# EasyEDA Pro project rp2354bv1e1.epro

# Schematic Schematic1

## Sheets
1 P1: Board Name: Board1; Create Date: 2026-07-01; Page Name: P1; Project Name: rp2354b; Schematic Name: Schematic1; Update Date: 2026-07-01; Company: EasyEDA.com; Page Size: A4; Version: V1.0
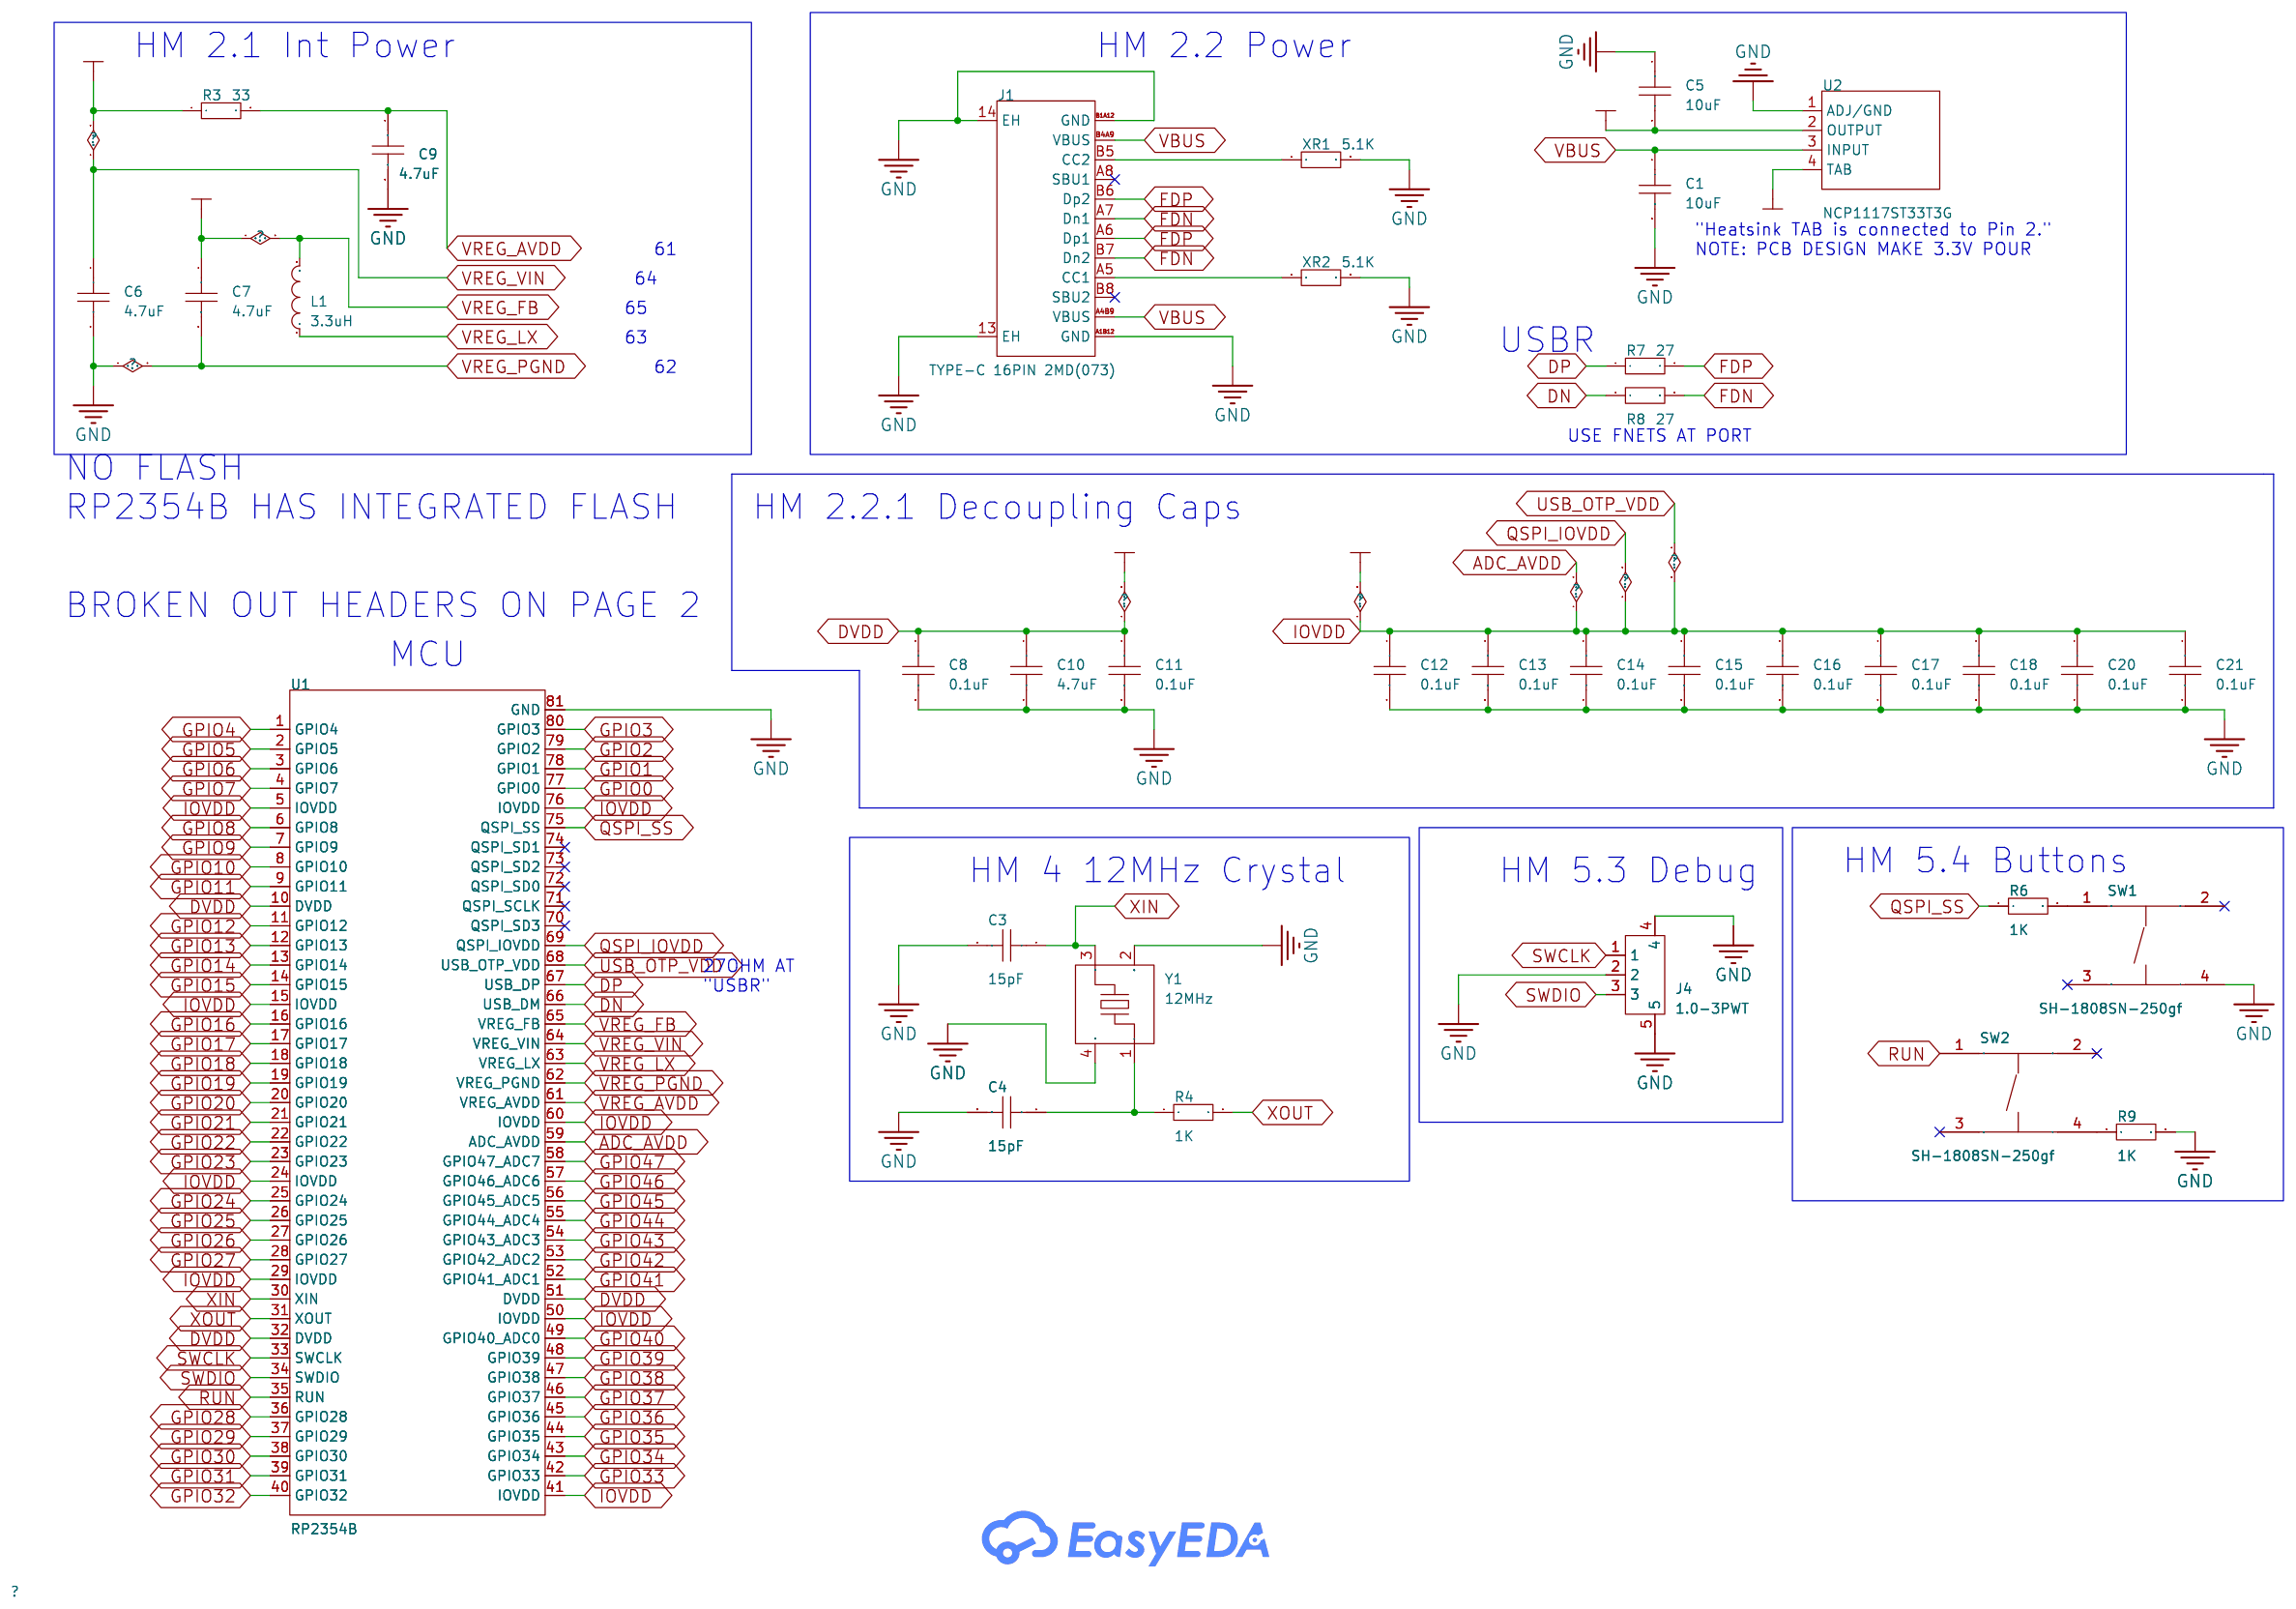
[diagram p0: P1]
2 P2: Create Date: 2026-06-30; Page Name: P2; Update Date: 2026-07-09
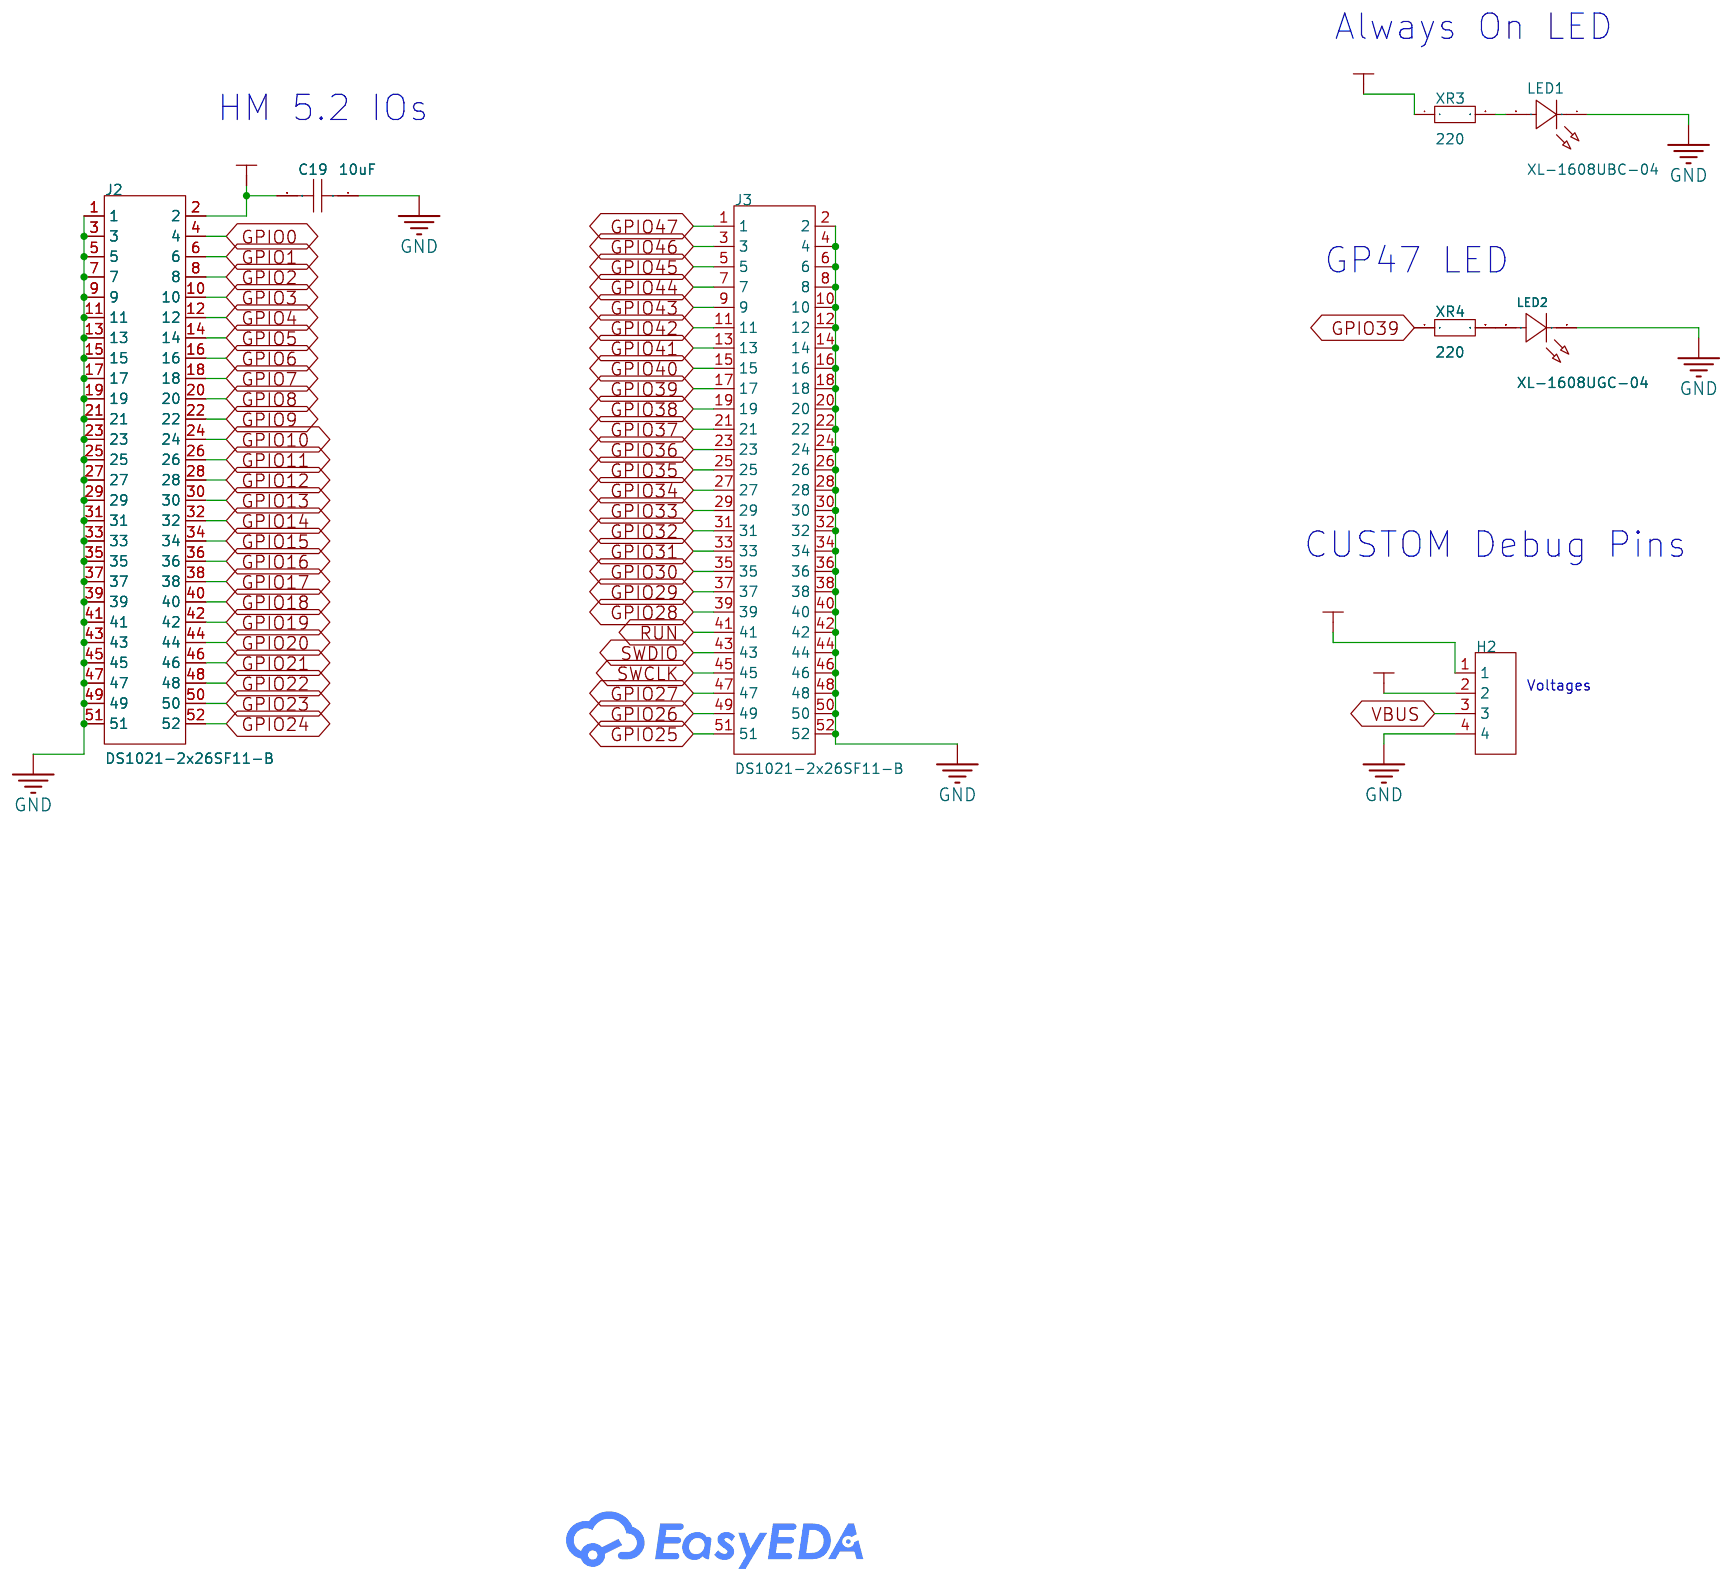
[diagram p1: P2]

## Parts
sheet P1
C1  10uF  [C0603]
C3  15pF  [C0603]
C4  15pF  [C0603]
C5  10uF  [C0603]
C6  4.7uF  [C0603]
C7  4.7uF  [C0603]
C8  0.1uF  [C0603]
C9  4.7uF  [C0603]
C10  4.7uF  [C0603]
C11  0.1uF  [C0603]
C12  0.1uF  [C0603]
C13  0.1uF  [C0603]
C14  0.1uF  [C0603]
C15  0.1uF  [C0603]
C16  0.1uF  [C0603]
C17  0.1uF  [C0603]
C18  0.1uF  [C0603]
C20  0.1uF  [C0603]
C21  0.1uF  [C0603]
J1  TYPE-C 16PIN 2MD(073)  [USB-C-SMD_TYPE-C-16PIN-2MD-073]
J4  1.0-3PWT  [CONN-SMD_3P-P1.00_C3029342]
L1  3.3uH  [IND-SMD_L2.0-W1.6_AOTA-B201610S3R3-101-T]
R3  33  [R0603]
R4  1K  [R0603]
R6  1K  [R0603]
R7  27  [R0603]
R8  27  [R0603]
R9  1K  [R0603]
SW1  SH-1808SN-250gf  [SW-SMD_4P-L4.2-W3.4-P2.15-LS5.2]
SW2  SH-1808SN-250gf  [SW-SMD_4P-L4.2-W3.4-P2.15-LS5.2]
U1  RP2354B  [QFN-80_L10.0-W10.0-P0.40-TL-EP3.4]
U2  NCP1117ST33T3G  [SOT-223-3_L6.5-W3.4-P2.30-LS7.0-BR]
XR1  5.1K  [R0603]
XR2  5.1K  [R0603]
Y1  12MHz  [CRYSTAL-SMD_4P-L3.2-W2.5-BL]
sheet P2
C19  10uF  [C0603]
H2  HX PH254-01-04-Z-L11.5 straight pin header  [HDR-TH_4P-HX-PH254-01-04-Z-L11.5]
J2  DS1021-2x26SF11-B  [HDR-TH_52P-P2.54-V-M-R2-C26-S2.54]
J3  DS1021-2x26SF11-B  [HDR-TH_52P-P2.54-V-M-R2-C26-S2.54]
LED1  XL-1608UBC-04  [LED0603-RD_BLUE]
LED2  XL-1608UGC-04  [LED0603-RD_GREEN]
XR3  220  [R0603]
XR4  220  [R0603]

## Library data of the parts
C1 C3-C21 = CAP_0603: Supplier Footprint: 0603
J1 = TYPE-C 16PIN 2MD(073): Connector Type:Type-C Protocol Standard:- Gender:Female Mounting Type:Surface Mount, Right Angle Number of Contacts:16P Number of Ports:1 Current Rating-Power:3A Voltage Rating:5V Connect-Disconnect Life:10,000 Cycles Supplementary Features:- Center Heigh; LCSC Part Name: Type-C 母 卧贴; Supplier Part: C2765186; Manufacturer: SHOU HAN(首韩); Supplier Footprint: SMD; JLCPCB Part Class: Extended Part; Datasheet: https://item.szlcsc.com/datasheet/TYPE-C%252016PIN%25202MD(073)/2901843.html; Supplier: LCSC; Connector Type: Type-C; Gender: Female; Mounting Type: Surface Mount, Right Angle; Number of Contacts: 16P; Number of Ports: 1; Current Rating-Power: 3A; Voltage Rating: 5V; Connect-Disconnect Life: 10,000 Cycles; Detection color: Black; Operating Temperature: -25℃~+85℃
J4 = 1.0-3PWT: Pins Structure:1x3P Pitch:1mm Mounting Type:Surface Mount, Right Angle Reference Series:SH Number of Pins:3P Number of Rows:1 Number of PINs Per Row:3 Contact Material:Phosphor bronze Contact Plating:Tin Operating Temperature:-20℃~+85℃ Operating Temperatu; LCSC Part Name: 1x3P 间距:1mm 卧贴 系列:SH; Supplier Part: C2763613; Manufacturer: FG(富港); Supplier Footprint: SMD,P=1mm,卧贴; JLCPCB Part Class: Extended Part; Datasheet: https://item.szlcsc.com/datasheet/1.0-3PWT/2893484.html; Supplier: LCSC; Pins Structure: 1x3P; Pitch: 1mm; Mounting Type: Surface Mount, Right Angle; Reference Series: SH; Number of Pins: 3P; Number of Rows: 1; Number of PINs Per Row: 3; Contact Material: Phosphor bronze; Contact Plating: Tin; Operating Temperature: -20℃~+85℃; Plastic Material: PA9T; Color: Beige; Z-Height of the Board: 3.05mm; Y-Width of Bottom Edge on Board: 3.75mm
L1 = AOTA-B201610S3R3-101-T: Inductance:3.3uH Current Rating:2.1A Current - Saturation(Isat):2.4A DC Resistance(DCR):115mΩ Type:Molded Inductor; LCSC Part Name: 3.3uH 2.4A; Supplier Part: C42411119; Manufacturer: ABRACON; Supplier Footprint: 0806; JLCPCB Part Class: Extended Part; Datasheet: https://item.szlcsc.com/datasheet/AOTA-B201610S3R3-101-T/44392932.html; Supplier: LCSC; Current Rating: 2.1A; Current - Saturation(Isat): 2.4A; DC Resistance(DCR): 115mΩ; Type: Molded Inductor
R3 R4 R6-R9 XR1-XR4 = Res_0603: Supplier Footprint: 0603
SW1 SW2 = SH-1808SN-250gf: Circuit:SPST-NO Actuator Style:Oval Button Operating Force:2.5N Mounting Type:Surface Mount,Vertical Length:4.2mm Width:3.4mm Switch Height:2.5mm with Bracket:Without Bracket Contact Current:50mA Voltage Rating:12V Actuator/Cap Color:White Termination Sty; LCSC Part Name: TS3425PA 250gf编带; Supplier Part: C52092028; Manufacturer: SHOU HAN(首韩); Supplier Footprint: SMD; JLCPCB Part Class: Extended Part; Datasheet: https://item.szlcsc.com/datasheet/SH-1808SN-250gf/54864052.html; Supplier: LCSC; Circuit: SPST-NO; Actuator Style: Oval Button; Operating Force: 2.5N; Mounting Type: Surface Mount,Vertical; Length: 4.2mm; Width: 3.4mm; Switch Height: 2.5mm; with Bracket: Without Bracket; Contact Current: 50mA; Voltage Rating: 12V; Actuator/Cap Color: White; Termination Style: PC Pin; Life: 50,000 cycles; Operating Temperature: -20℃~+70℃
U1 = RP2354B_C39843328: Program Storage Size:2MB Program Memory Type:OTP Number of I/O:48 Features:True random number generator (TRNG)；External pin reset (NRST); LCSC Part Name: 高性能安全微控制器; Supplier Part: C39843328; Manufacturer: Raspberry Pi(树莓派); Supplier Footprint: QFN-80-EP(10x10); JLCPCB Part Class: Extended Part; Datasheet: https://item.szlcsc.com/datasheet/RP2354B/41574627.html; Supplier: LCSC; Program Storage Size: 2MB; Program Memory Type: OTP; Number of I/O: 48; Features: True random number generator (TRNG)；External pin reset (NRST)
U2 = NCP1117ST33T3G: Output Configuration:Positive Voltage - Supply:20V Output Voltage:3.3V Output Voltage:3.3V Output Current:1A Power Supply Rejection Ratio (PSRR):62dB@(120Hz) Voltage Dropout:1.2V@(800mA) standby current:6mA Noise:0.003%Vout Features:Short Circuit Protecti; LCSC Part Name: 3.3V 1A 20V; Supplier Part: C26537; Manufacturer: onsemi(安森美); Supplier Footprint: SOT-223; JLCPCB Part Class: Extended Part; Datasheet: https://item.szlcsc.com/datasheet/NCP1117ST33T3G/27282.html; Supplier: LCSC; Output Configuration: Positive; Voltage - Supply: 20V; Output Voltage: 3.3V; Output Current: 1A; Power Supply Rejection Ratio (PSRR): 62dB@(120Hz); Voltage Dropout: 1.2V@(800mA); standby current: 6mA; Noise: 0.003%Vout; Features: Short Circuit Protection；Over Current Protection；Thermal shutdown; Operating Temperature: 0℃~+125℃@(Ta); Output Type: Fixed; Number of Outputs: 1
Y1 = ABM8-272-T3_C20625731: Type:Crystal Oscillator Frequency:12MHz Normal temperature Frequency Tolerance:±30ppm Normal temperature Frequency Tolerance:±30ppm Load Capacitance:10pF Frequency Stability:±30ppm Frequency Stability:±30ppm Equivalent Series Resistance(ESR):50Ω Operating; LCSC Part Name: 12MHz ±30ppm 10pF; Supplier Part: C20625731; Manufacturer: ABRACON; Manufacturer Part: ABM8-272-T3; Supplier Footprint: SMD3225-4P; JLCPCB Part Class: Extended Part; Datasheet: https://item.szlcsc.com/datasheet/ABM8-272-T3/22032038.html; Supplier: LCSC; Type: Crystal Oscillator; Normal temperature Frequency Tolerance: ±30ppm; Load Capacitance: 10pF; Frequency Stability: ±30ppm; Equivalent Series Resistance(ESR): 50Ω; Operating Temperature: -40℃~+85℃
H2 = HX PH254-01-04-Z-L11.5 straight pin header: Pin Structure:1x4P Pitch:2.54mm Circluar Pins/Square Pins:Pin Header Mounting Type:Through Hole Number of Rows:1 Number of Pins:4P Current Rating:3A Voltage Rating (Max):1kV Length of Mating Pin:6mm Insulation Height:2.5mm Length of End Connection Pin:3mm; LCSC Part Name: 1x4P 间距:2.54mm 方针 直插; Supplier Part: C52016392; Manufacturer: hanxia(韩下); Supplier Footprint: 插件,P=2.54mm; JLCPCB Part Class: Extended Part; Datasheet: https://item.szlcsc.com/datasheet/HX%2520PH254-01-04-Z-L11.5%2520straight%2520pin%2520header/54760437.html; Supplier: LCSC; Pin Structure: 1x4P; Pitch: 2.54mm; Circluar Pins/Square Pins: Pin Header; Mounting Type: Through Hole; Number of Rows: 1; Number of Pins: 4P; Current Rating: 3A; Voltage Rating (Max): 1kV; Length of Mating Pin: 6mm; Insulation Height: 2.5mm; Length of End Connection Pin: 3mm; Contact Material: Brass; Contact Plating: Gold; Operating Temperature: -40℃~+105℃
J2 J3 = DS1021-2x26SF11-B: Pin Structure:2x26P Pitch:2.54mm Row Spacing:2.54mm Circluar Pins/Square Pins:Pin Header Mounting Type:Through Hole Number of Rows:2 Number of Pins:52P Current Rating:3A Voltage Rating (Max):250V Contact Material:Copper Alloy Contact Plating:Gold Operatin; LCSC Part Name: 2x26P 间距:2.54mm 方针 直插; Supplier Part: C7430422; Manufacturer: CONNFLY; Supplier Footprint: 插件,P=2.54mm; JLCPCB Part Class: Extended Part; Datasheet: https://item.szlcsc.com/datasheet/DS1021-2x26SF11-B/8430075.html; Supplier: LCSC; Pin Structure: 2x26P; Pitch: 2.54mm; Row Spacing: 2.54mm; Circluar Pins/Square Pins: Pin Header; Mounting Type: Through Hole; Number of Rows: 2; Number of Pins: 52P; Current Rating: 3A; Voltage Rating (Max): 250V; Contact Material: Copper Alloy; Contact Plating: Gold; Operating Temperature: -40℃~+105℃; Color: Black
LED1 = XL-1608UBC-04: Lamp Holder Type:1.6mm x 0.8mm square LED Illumination Color:Blue Voltage - Forward(Vf):3.3V Voltage - Forward(Vf):3.3V Power(Watts):70mW Forward Current:20mA Wavelength - Dominant:455nm~475nm Wavelength - Dominant:455nm~475nm Peak Wavelength:470nm Peak W; LCSC Part Name: 0603蓝色贴片式发光二极管; Supplier Part: C965807; Manufacturer: XINGLIGHT(成兴光); Supplier Footprint: 0603; JLCPCB Part Class: Extended Part; Datasheet: https://item.szlcsc.com/datasheet/XL-1608UBC-04/1051416.html; Supplier: LCSC; Lamp Holder Type: 1.6mm x 0.8mm square LED; Illumination Color: Blue; Voltage - Forward(Vf): 3.3V; Power(Watts): 70mW; Forward Current: 20mA; Wavelength - Dominant: 455nm~475nm; Peak Wavelength: 470nm; Diode Configuration: Discrete Diode; Lens Color: Water Clear; Luminous Intensity: 300mcd; Viewing Angle: 120°; Mounting Style: Top-mount; Operating Temperature: -40℃~+85℃
LED2 = XL-1608UGC-04: Lamp Holder Type:1.6mm x 0.8mm square LED Illumination Color:Emerald Green Voltage - Forward(Vf):3.3V Voltage - Forward(Vf):3.3V Power(Watts):70mW Forward Current:20mA Wavelength - Dominant:515nm~535nm Wavelength - Dominant:515nm~535nm Peak Wavelength:525; LCSC Part Name: 0603翠绿贴片式发光二极管; Supplier Part: C965804; Manufacturer: XINGLIGHT(成兴光); Supplier Footprint: 0603; JLCPCB Part Class: Extended Part; Datasheet: https://item.szlcsc.com/datasheet/XL-1608UGC-04/1051413.html; Supplier: LCSC; Lamp Holder Type: 1.6mm x 0.8mm square LED; Illumination Color: Emerald Green; Voltage - Forward(Vf): 3.3V; Power(Watts): 70mW; Forward Current: 20mA; Wavelength - Dominant: 515nm~535nm; Peak Wavelength: 525nm; Diode Configuration: Discrete Diode; Lens Color: Water Clear; Luminous Intensity: 810mcd; Viewing Angle: 120°; Mounting Style: Top-mount; Operating Temperature: -40℃~+85℃

## Nets
1V1: C7.1 C8.1 C10.1 C11.1 H2.2 L1.2 U1.10(DVDD) U1.32(DVDD) U1.51(DVDD) U1.65(VREG_FB)
3V3: C5.2 C6.1 C12.1 C13.1 C14.1 C15.1 C16.1 C17.1 C18.1 C19.2 C20.1 C21.1 H2.1 J2.2 R3.1 U1.5(IOVDD) U1.15(IOVDD) U1.24(IOVDD) U1.29(IOVDD) U1.41(IOVDD) U1.50(IOVDD) U1.59(ADC_AVDD) U1.60(IOVDD) U1.64(VREG_VIN) U1.68(USB_OTP_VDD) U1.69(QSPI_IOVDD) U1.76(IOVDD) U2.2(OUTPUT) U2.4(TAB) XR3.1
GND: C1.2 C3.2 C4.2 C5.1 C6.2 C7.2 C8.2 C9.2 C10.2 C11.2 C12.2 C13.2 C14.2 C15.2 C16.2 C17.2 C18.2 C19.1 C20.2 C21.2 H2.4 J1.13(EH) J1.14(EH) J1.A1B12(GND) J1.B1A12(GND) J2.1 J2.3 J2.5 J2.7 J2.9 J2.11 J2.13 J2.15 J2.17 J2.19 J2.21 J2.23 J2.25 J2.27 J2.29 J2.31 J2.33 J2.35 J2.37 J2.39 J2.41 J2.43 J2.45 J2.47 J2.49 J2.51 J3.2 J3.4 J3.6 J3.8 J3.10 J3.12 J3.14 J3.16 J3.18 J3.20 J3.22 J3.24 J3.26 J3.28 J3.30 J3.32 J3.34 J3.36 J3.38 J3.40 J3.42 J3.44 J3.46 J3.48 J3.50 J3.52 J4.2 J4.4 J4.5 LED1.1(K) LED2.1(K) R9.2 SW1.4 U1.62(VREG_PGND) U1.81(GND) U2.1(ADJ/GND) XR1.2 XR2.2 Y1.2(GND) Y1.4(GND)
VBUS: C1.1 H2.3 J1.A4B9(VBUS) J1.B4A9(VBUS) U2.3(INPUT)
DN: R8.1 U1.66(USB_DM)
DP: R7.1 U1.67(USB_DP)
FDN: J1.A7(Dn1) J1.B7(Dn2) R8.2
FDP: J1.A6(Dp1) J1.B6(Dp2) R7.2
GPIO0: J2.4 U1.77(GPIO0)
GPIO1: J2.6 U1.78(GPIO1)
GPIO2: J2.8 U1.79(GPIO2)
GPIO3: J2.10 U1.80(GPIO3)
GPIO4: J2.12 U1.1(GPIO4)
GPIO5: J2.14 U1.2(GPIO5)
GPIO6: J2.16 U1.3(GPIO6)
GPIO7: J2.18 U1.4(GPIO7)
GPIO8: J2.20 U1.6(GPIO8)
GPIO9: J2.22 U1.7(GPIO9)
GPIO10: J2.24 U1.8(GPIO10)
GPIO11: J2.26 U1.9(GPIO11)
GPIO12: J2.28 U1.11(GPIO12)
GPIO13: J2.30 U1.12(GPIO13)
GPIO14: J2.32 U1.13(GPIO14)
GPIO15: J2.34 U1.14(GPIO15)
GPIO16: J2.36 U1.16(GPIO16)
GPIO17: J2.38 U1.17(GPIO17)
GPIO18: J2.40 U1.18(GPIO18)
GPIO19: J2.42 U1.19(GPIO19)
GPIO20: J2.44 U1.20(GPIO20)
GPIO21: J2.46 U1.21(GPIO21)
GPIO22: J2.48 U1.22(GPIO22)
GPIO23: J2.50 U1.23(GPIO23)
GPIO24: J2.52 U1.25(GPIO24)
GPIO25: J3.51 U1.26(GPIO25)
GPIO26: J3.49 U1.27(GPIO26)
GPIO27: J3.47 U1.28(GPIO27)
GPIO28: J3.39 U1.36(GPIO28)
GPIO29: J3.37 U1.37(GPIO29)
GPIO30: J3.35 U1.38(GPIO30)
GPIO31: J3.33 U1.39(GPIO31)
GPIO32: J3.31 U1.40(GPIO32)
GPIO33: J3.29 U1.42(GPIO33)
GPIO34: J3.27 U1.43(GPIO34)
GPIO35: J3.25 U1.44(GPIO35)
GPIO36: J3.23 U1.45(GPIO36)
GPIO37: J3.21 U1.46(GPIO37)
GPIO38: J3.19 U1.47(GPIO38)
GPIO39: J3.17 U1.48(GPIO39) XR4.1
GPIO40: J3.15 U1.49(GPIO40_ADC0)
GPIO41: J3.13 U1.52(GPIO41_ADC1)
GPIO42: J3.11 U1.53(GPIO42_ADC2)
GPIO43: J3.9 U1.54(GPIO43_ADC3)
GPIO44: J3.7 U1.55(GPIO44_ADC4)
GPIO45: J3.5 U1.56(GPIO45_ADC5)
GPIO46: J3.3 U1.57(GPIO46_ADC6)
GPIO47: J3.1 U1.58(GPIO47_ADC7)
QSPI_SS: R6.1 U1.75(QSPI_SS)
RUN: J3.41 SW2.1 U1.35(RUN)
SWCLK: J3.45 J4.1 U1.33(SWCLK)
SWDIO: J3.43 J4.3 U1.34(SWDIO)
VREG_AVDD: C9.1 R3.2 U1.61(VREG_AVDD)
VREG_LX: L1.1 U1.63(VREG_LX)
XIN: C3.1 U1.30(XIN) Y1.3
XOUT: R4.2 U1.31(XOUT)
$1N1729: J1.B5(CC2) XR1.1
$1N1837: J1.A5(CC1) XR2.1
$1N3371: C4.1 R4.1 Y1.1
$1N4063: R6.2 SW1.1
$1N4245: R9.1 SW2.4
$2N5716: LED1.2(A) XR3.2
$2N5881: LED2.2(A) XR4.2

Not connected (* = marked no-connect by the designer): J1 A8(SBU1)* B8(SBU2)*; SW1 2* 3*; SW2 2* 3*; U1 70(QSPI_SD3)* 71(QSPI_SCLK)* 72(QSPI_SD0)* 73(QSPI_SD2)* 74(QSPI_SD1)*

## Notes on the sheets
sheet 1
- HM 2.1 Int Power
- HM 2.2 Power
- 61
- "Heatsink TAB is connected to Pin 2."
  NOTE: PCB DESIGN MAKE 3.3V POUR
- 64
- 65
- 63
- USBR
- 62
- USE FNETS AT PORT
- NO FLASH
  RP2354B HAS INTEGRATED FLASH
- HM 2.2.1 Decoupling Caps
- BROKEN OUT HEADERS ON PAGE 2
- MCU
- HM 5.4 Buttons
- HM 4 12MHz Crystal
- HM 5.3 Debug
- 27OHM AT
  "USBR"
sheet 2
- Always On LED
- HM 5.2 IOs
- GP47 LED
- CUSTOM Debug Pins
- Voltages

# Board PCB1
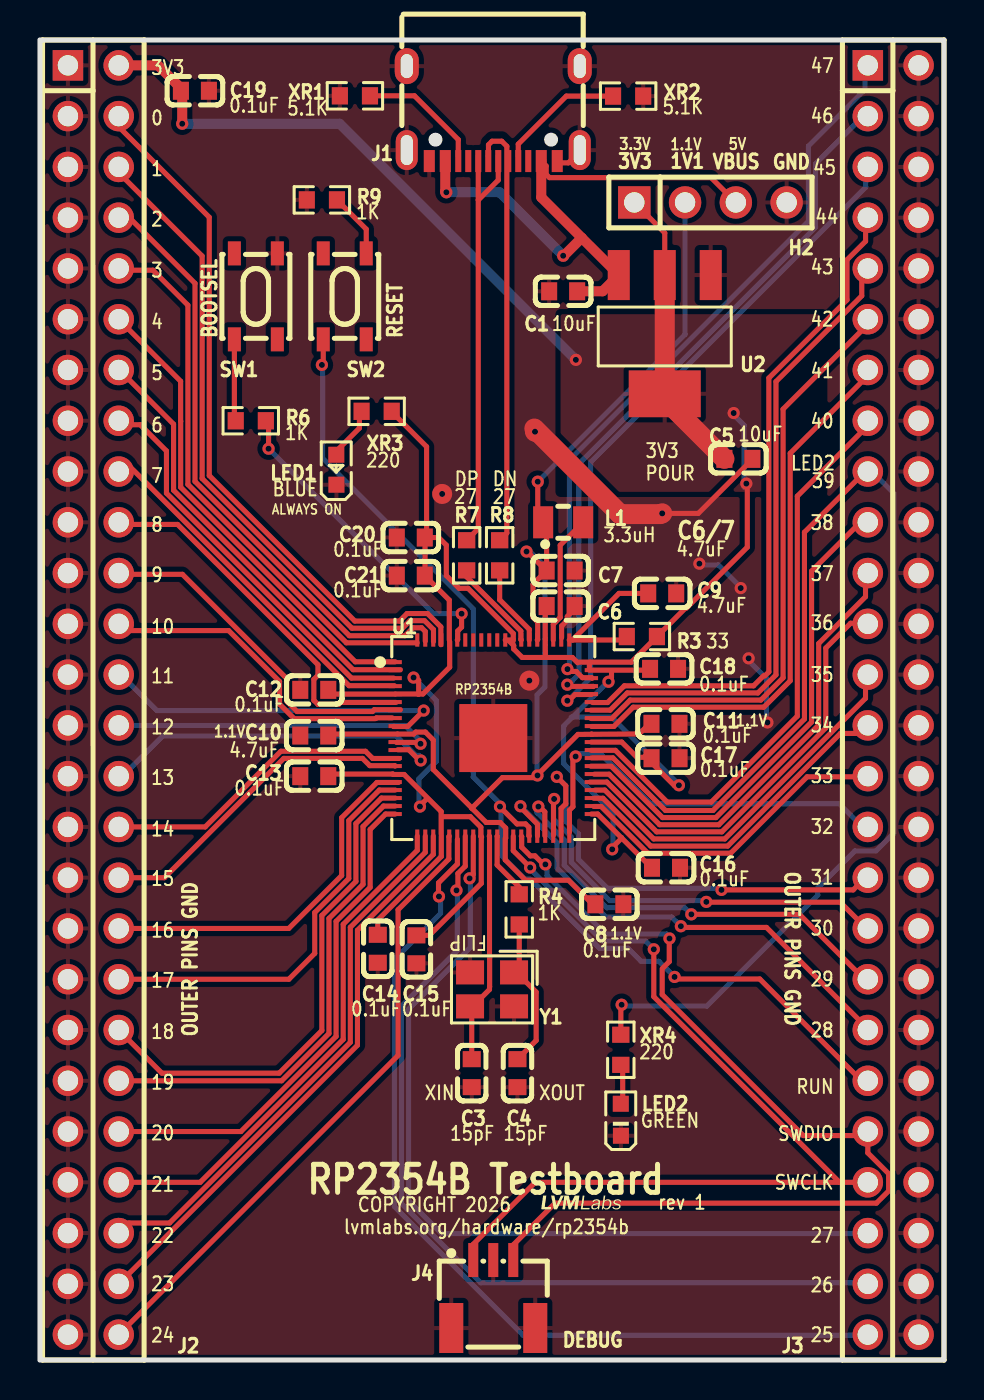
[diagram p2: board, top side]
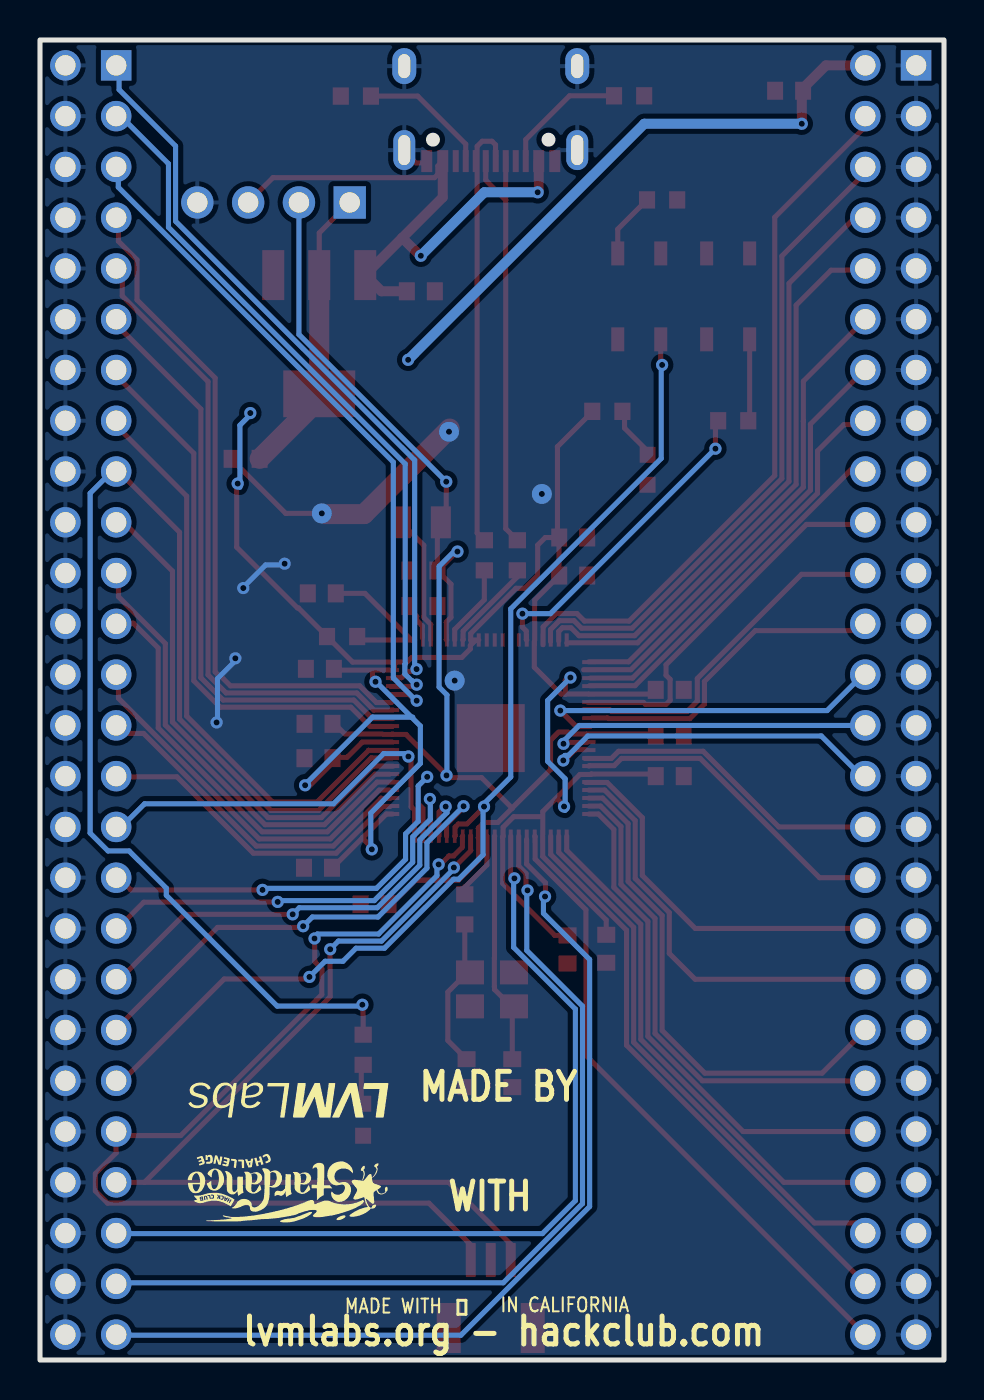
[diagram p3: board, bottom side, seen from below]

Outline 45.21 x 66.04 mm; copper layers: Top Layer, Bottom Layer. Coordinates in mm from the lower left corner of the outline.
Outline path: rectangle 0,66.04 45.21,0
Stack: Top Layer 0.035mm / Dielectric1 1.51mm FR4 er 4.5 / Bottom Layer 0.035mm

## Design rules (mm)
template: JLCPCB Capability(Two Layers Board)
spacing copperThickness1oz (default): track to track 0.102, other pairs 0.152 to 0.3
spacing copperThickness2oz: track to track 0.203, other pairs 0.152 to 0.3
track width copperThickness1oz (default): min 0.127, default 0.254, max 2.54
track width copperThickness2oz: min 0.203, default 0.254, max 2.54
differential pair differentialPair (default): width min 0.127, default 0.254, max 2.54; gap min 0.152, default 0.152
via viaSize (default): diameter min 0.5, default 0.61, max 10; hole min 0.3, default 0.305, max 6.3

## Placement (name value [footprint] x y rotation side)
C1  10uF  [C0603]  26.16 53.47 180 top
C3  15pF  [C0603]  21.59 14.35 270 top
C4  15pF  [C0603]  23.88 14.35 270 top
C5  10uF  [C0603]  34.93 45.08 180 top
C6  4.7uF  [C0603]  26.03 37.72 0 top
C7  4.7uF  [C0603]  26.03 39.5 0 top
C8  0.1uF  [C0603]  28.47 22.8 0 top
C9  4.7uF  [C0603]  31.12 38.35 0 top
C10  4.7uF  [C0603]  13.72 31.24 180 top
C11  0.1uF  [C0603]  31.28 31.83 0 top
C12  0.1uF  [C0603]  13.72 33.53 180 top
C13  0.1uF  [C0603]  13.72 29.21 180 top
C14  0.1uF  [C0603]  16.89 20.57 270 top
C15  0.1uF  [C0603]  18.82 20.55 270 top
C16  0.1uF  [C0603]  31.31 24.63 0 top
C17  0.1uF  [C0603]  31.28 30.11 0 top
C18  0.1uF  [C0603]  31.21 34.58 0 top
C19  10uF  [C0603]  7.75 63.5 180 top
C20  0.1uF  [C0603]  18.54 41.15 180 top
C21  0.1uF  [C0603]  18.54 39.24 180 top
H2  HX PH254-01-04-Z-L11.5 straight pin header  [HDR-TH_4P-HX-PH254-01-04-Z-L11.5]  33.53 57.91 0 top
J1  TYPE-C 16PIN 2MD(073)  [USB-C-SMD_TYPE-C-16PIN-2MD-073]  22.67 62.36 180 top
J2  DS1021-2x26SF11-B  [HDR-TH_52P-P2.54-V-M-R2-C26-S2.54]  2.67 33.02 270 top
J3  DS1021-2x26SF11-B  [HDR-TH_52P-P2.54-V-M-R2-C26-S2.54]  42.67 33.02 270 top
J4  1.0-3PWT  [CONN-SMD_3P-P1.00_C3029342]  22.67 3.3 0 top
L1  3.3uH  [IND-SMD_L2.0-W1.6_AOTA-B201610S3R3-101-T]  26.16 41.91 180 top
LED1  XL-1608UBC-04  [LED0603-RD_BLUE]  14.82 44.54 90 top
LED2  XL-1608UGC-04  [LED0603-RD_GREEN]  29.05 12.02 90 top
R3  33  [R0603]  30.1 36.19 180 top
R4  1K  [R0603]  23.97 22.54 90 top
R6  1K  [R0603]  10.54 46.99 180 top
R7  27  [R0603]  21.34 40.26 90 top
R8  27  [R0603]  22.99 40.26 90 top
R9  1K  [R0603]  14.1 58.04 180 top
SW1  SH-1808SN-250gf  [SW-SMD_4P-L4.2-W3.4-P2.15-LS5.2]  10.79 53.21 90 top
SW2  SH-1808SN-250gf  [SW-SMD_4P-L4.2-W3.4-P2.15-LS5.2]  15.24 53.21 90 top
U1  RP2354B  [QFN-80_L10.0-W10.0-P0.40-TL-EP3.4]  22.67 31.11 0 top
U2  NCP1117ST33T3G  [SOT-223-3_L6.5-W3.4-P2.30-LS7.0-BR]  31.24 51.31 90 top
XR1  5.1K  [R0603]  15.75 63.25 180 top
XR2  5.1K  [R0603]  29.41 63.23 0 top
XR3  220  [R0603]  16.84 47.46 180 top
XR4  220  [R0603]  29.05 15.52 270 top
Y1  12MHz  [CRYSTAL-SMD_4P-L3.2-W2.5-BL]  22.61 18.54 180 top

## Footprints (pads in the part's own frame, mm; a bottom-side part is the same pattern mirrored in y, then rotated)
C0603
  rect 0.8x0.9 smd: 1(-0.7,0) 2(0.7,0)
CONN-SMD_3P-P1.00_C3029342
  rect 0.5x1.7 smd: 1(-1,1.7) 2(0,1.7) 3(1,1.7)
  rect 1.2x2.5 smd: 4(2.1,-1.7) 5(-2.1,-1.7)
CRYSTAL-SMD_4P-L3.2-W2.5-BL
  rect 1.4x1.2 smd: 1(-1.1,-0.85) 2(1.1,-0.85) 3(1.1,0.85) 4(-1.1,0.85)
HDR-TH_4P-HX-PH254-01-04-Z-L11.5
  rect 1.62x1.62 hole 1.02: 1(-3.81,0)
  round 1.62 hole 1.02: 2(-1.27,0) 3(1.27,0) 4(3.81,0)
HDR-TH_52P-P2.54-V-M-R2-C26-S2.54
  rect 1.524x1.524 hole 1.02: 1(-31.75,-1.27)
  round 1.524 hole 1.02: 2(-31.75,1.27) 3(-29.21,-1.27) 4(-29.21,1.27) 5(-26.67,-1.27) 6(-26.67,1.27) 7(-24.13,-1.27) 8(-24.13,1.27) 9(-21.59,-1.27) 10(-21.59,1.27) 11(-19.05,-1.27) 12(-19.05,1.27) 13(-16.51,-1.27) 14(-16.51,1.27) 15(-13.97,-1.27) 16(-13.97,1.27) 17(-11.43,-1.27) 18(-11.43,1.27) 19(-8.89,-1.27) 20(-8.89,1.27) 21(-6.35,-1.27) 22(-6.35,1.27) 23(-3.81,-1.27) 24(-3.81,1.27) 25(-1.27,-1.27) 26(-1.27,1.27) 27(1.27,-1.27) 28(1.27,1.27) 29(3.81,-1.27) 30(3.81,1.27) 31(6.35,-1.27) 32(6.35,1.27) 33(8.89,-1.27) 34(8.89,1.27) 35(11.43,-1.27) 36(11.43,1.27) 37(13.97,-1.27) 38(13.97,1.27) 39(16.51,-1.27) 40(16.51,1.27) 41(19.05,-1.27) 42(19.05,1.27) 43(21.59,-1.27) 44(21.59,1.27) 45(24.13,-1.27) 46(24.13,1.27) 47(26.67,-1.27) 48(26.67,1.27) 49(29.21,-1.27) 50(29.21,1.27) 51(31.75,-1.27) 52(31.75,1.27)
IND-SMD_L2.0-W1.6_AOTA-B201610S3R3-101-T
  rect 1x1.6 smd: 1(-1,0) 2(1,0)
LED0603-RD_BLUE
  rect 0.8x0.8 smd: 1(-0.749,-0.004) 2(0.749,0.004)
LED0603-RD_GREEN
  rect 0.8x0.8 smd: 1(-0.799,-0.004) 2(0.799,0.004)
QFN-80_L10.0-W10.0-P0.40-TL-EP3.4
  rect 0.665x0.2 smd: 1(-4.907,3.8) 2(-4.907,3.4) 3(-4.907,3) 4(-4.907,2.6) 5(-4.907,2.2) 6(-4.907,1.8) 7(-4.907,1.4) 8(-4.907,1) 9(-4.907,0.6) 10(-4.907,0.2) 11(-4.907,-0.2) 12(-4.907,-0.6) 13(-4.907,-1) 14(-4.907,-1.4) 15(-4.907,-1.8) 16(-4.907,-2.2) 17(-4.907,-2.6) 18(-4.907,-3) 19(-4.907,-3.4) 20(-4.907,-3.8) 41(4.907,-3.8) 42(4.907,-3.4) 43(4.907,-3) 44(4.907,-2.6) 45(4.907,-2.2) 46(4.907,-1.8) 47(4.907,-1.4) 48(4.907,-1) 49(4.907,-0.6) 50(4.907,-0.2) 51(4.907,0.2) 52(4.907,0.6) 53(4.907,1) 54(4.907,1.4) 55(4.907,1.8) 56(4.907,2.2) 57(4.907,2.6) 58(4.907,3) 59(4.907,3.4) 60(4.907,3.8)
  rect 0.2x0.665 smd: 21(-3.8,-4.907) 22(-3.4,-4.907) 23(-3,-4.907) 24(-2.6,-4.907) 25(-2.2,-4.907) 26(-1.8,-4.907) 27(-1.4,-4.907) 28(-1,-4.907) 29(-0.6,-4.907) 30(-0.2,-4.907) 31(0.2,-4.907) 32(0.6,-4.907) 33(1,-4.907) 34(1.4,-4.907) 35(1.8,-4.907) 36(2.2,-4.907) 37(2.6,-4.907) 38(3,-4.907) 39(3.4,-4.907) 40(3.8,-4.907) 61(3.8,4.907) 62(3.4,4.907) 63(3,4.907) 64(2.6,4.907) 65(2.2,4.907) 66(1.8,4.907) 67(1.4,4.907) 68(1,4.907) 69(0.6,4.907) 70(0.2,4.907) 71(-0.2,4.907) 72(-0.6,4.907) 73(-1,4.907) 74(-1.4,4.907) 75(-1.8,4.907) 76(-2.2,4.907) 77(-2.6,4.907) 78(-3,4.907) 79(-3.4,4.907) 80(-3.8,4.907)
  rect 3.4x3.4 smd: 81(0,0)
R0603
  rect 0.806x0.864 smd: 1(-0.753,0) 2(0.753,0)
SOT-223-3_L6.5-W3.4-P2.30-LS7.0-BR
  rect 2.5x1.1 smd: 1(2.97,-2.3) 2(2.97,0) 3(2.97,2.3)
  rect 2.34x3.6 smd: 4(-2.97,0)
SW-SMD_4P-L4.2-W3.4-P2.15-LS5.2
  rect 1.2x0.65 smd: 1(-2.15,1.075) 2(2.15,1.075) 3(-2.15,-1.075) 4(2.15,-1.075)
USB-C-SMD_TYPE-C-16PIN-2MD-073
  oval 1.1x2 hole 0.6x1.5: 13(-4.325,1.825) 14(4.325,1.825)
  oval 1.2x1.8 hole 0.6x1.2: 13(-4.325,-2.375) 14(4.325,-2.375)
  rect 0.55x1.1 smd: A1B12(-3.2,2.375) A4B9(-2.4,2.375) B1A12(3.2,2.375) B4A9(2.4,2.375)
  rect 0.3x1.1 smd: A5(-1.25,2.375) A6(-0.25,2.375) A7(0.25,2.375) A8(1.25,2.375) B5(1.75,2.375) B6(0.75,2.375) B7(-0.75,2.375) B8(-1.75,2.375)

## Nets
As in the schematic.

Pads without a net: J1 A8 B8; SW1 2 3; SW2 2 3; U1 70 71 72 73 74

## Via types
v1: diameter 1, hole 0.305, Top Layer to Bottom Layer, 4 vias
v2: diameter 0.61, hole 0.305, Top Layer to Bottom Layer, 46 vias

## Routing (per net, layer and track width the routed paths; a pad name or vN(x,y) marks a point on that pad's centre or on a via; arc(x,y) is an arc through that point)
1V1: length 68
  Top Layer w0.254: U1.65 24.89,36.04 24.89,36.92 24.66,37.15 24.66,38.82 C7.1 25.34,41.74 L1.2 24.89,42.18 v2(24.89,43.94) ; 21.6,27.61 21.6,27.61 19.67,29.54 19.67,31.02 19.27,31.41 18.79,31.41 18.69,31.32 17.88,31.32 17.87,31.32 ; 21.6,27.61 23.12,29.14 24.74,29.14 26.9,31.3 27.59,31.3 ; 21.6,27.61 21.64,27.58 ; 21.6,27.61 21.6,27.61 22.31,26.89 23.01,26.89 23.29,26.61 23.29,26.11 23.26,26.08 ; C10.1 14.49,31.31 U1.10 ; 25.31,39.5 24.41,40.39 24.28,40.39 ; U1.51 27.59,31.3 ; 27.59,31.3 29.97,31.32 30.47,31.82 ; 27.59,31.3 27.59,31.3 ; 23.27,26.08 23.27,25.02 24.28,24 26.43,24 27.7,22.73
  Bottom Layer w0.254: v2(24.89,43.94) 32.26,51.31 H2.2 ; 24.42,40.53 25.25,39.7 25.25,33.67 24.86,33.27 24.86,29.3
  vias: v2(24.33,40.45) v2(24.88,29.25)
3V3: length 161.1
  Top Layer w0.254: 26.88,34.91 27.49,34.91 27.5,34.92 ; 30.52,34.45 30.46,34.51 U1.59 ; 35.37,43.83 35.37,40.66 32.33,37.62 32.28,37.62 30.95,36.29 ; C12.1 14.63,33.31 U1.5 ; 29.08,26.12 30.6,24.6 30.6,24.5 ; 29.08,26.12 29.08,26.14 ; 29.08,26.12 29.08,26.11 28.55,25.57 ; 29.08,26.12 27.89,27.31 U1.41 ; 20.09,27.18 21.52,27.18 22.05,26.66 22.05,26.2 22.08,26.16 ; U1.76 20.47,38.02 19.28,39.21 ; 20.06,26.31 20.06,27.44 18.21,29.29 17.67,29.29 17.64,29.32 ; 26.88,34.88 26.62,35.15 24.11,35.15 23.69,35.57 23.69,35.74 23.44,35.99 ; C6.1 25.27,37.65 25.27,36.07 25.27,35.23 25.2,35.16 ; 18.72,34.22 18.94,34 18.94,33.32 ; U1.69 U1.68 23.67,36.35 21.41,38.61 20.96,38.61 20.32,39.24 20.32,40.77 19.94,41.15 C20.1 ; H2.1 31.24,56.39 U2.2 ; 17.78,33.32 18.94,33.32 ; 18.94,33.32 18.94,33.3 ; 18.94,33.32 19.15,33.32 20.49,34.66 20.49,35.94 ; 19.26,41.07 19.26,39.18 19.21,39.14 ; 27.47,34.51 27.47,34.89 ; 22.07,26.16 22.07,23.85 19.47,21.25 C15.1 ; 17.64,29.31 14.52,29.31 C13.1 ; 30.25,30.15 29.86,30.15 29.09,30.91 U1.50 ; U1.60 29.57,34.91 R3.1 ; U1.24 20.07,25.19 16.89,22.01 C14.1 ; 19.08,27.68 19.08,27.81 19.35,28.08 ; 17.56,47.47 19.33,45.69 19.33,41.27 19.18,41.11 ; 28.49,34.06 28.58,34.15 28.58,34.44 ; 30.25,30.21 31.73,28.74 31.96,28.74
  Top Layer w0.5: 7.11,63.56 5.9,64.77 J2.2 ; C19.2 7.11,63.43 v2(7.11,61.85)
  Top Layer w1: 34.22,45.08 31.24,48.07 U2.4 U2.2
  Bottom Layer w0.254: 26.56,32.16 26.63,32.16 ; 26.63,32.16 26.19,31.72 26.19,29.85 ; 26.63,32.16 28.58,32.16 31.95,28.79 ; 26.63,32.16 28.4,33.94 ; 18.75,34.06 19.82,32.99 19.82,29.95 18.95,29.08 18.95,27.49 ; 28.66,25.49 28.66,27.37 26.18,29.85 ; 34.68,47.29 35.21,46.76 35.21,43.66
  Bottom Layer w0.5: v2(26.8,50.04) 14.99,61.85 v2(7.11,61.85)
  vias: v2(18.68,34.14) v2(19,27.69) v2(28.43,33.93) v2(28.61,25.55) v2(31.95,28.75) v2(34.69,47.38) v2(35.32,43.85)
GND: length 22.7
  Top Layer w0.254: 25.89,59.89 26.42,59.89 26.9,60.37 ; v1(31.12,42.36) 32.92,42.36 35.53,44.97 ; 26.79,37.62 26.37,37.2 26.37,37.01 26.08,36.72 26.08,36.14
  Top Layer w1: 31.02,42.32 29,42.32 24.72,46.6
  Bottom Layer w0.254: 36.33,31.8 36.33,34.09 35.4,35.02 ; 33.02,39.78 33.92,39.78 35.06,38.64
  vias: v1(20.11,43.33) v1(24.47,33.99) v1(24.75,46.44) v2(32.97,39.84) v2(35.04,38.62) v2(35.44,35.1) v2(36.38,31.9)
VBUS: length 30.6
  Top Layer w0.254: H2.3 33.56,59.15 25.48,59.15 25.31,59.32 25.31,59.74 J1.A4B9
  Top Layer w0.5: v2(26.16,55.24) 26.19,55.24 27.09,56.14 ; v2(20.32,58.42) 20.27,58.47 J1.B4A9 ; 27.09,56.14 25.07,58.17 J1.A4B9 ; 27.09,56.14 28.94,54.29 U2.3 28.13,53.47 C1.1
  Bottom Layer w0.5: v2(20.32,58.42) 22.99,58.42 v2(26.16,55.24)
DN: length 4.1
  Top Layer w0.254: U1.66 24.47,36.55 22.99,38.03 R8.1
DP: length 4.6
  Top Layer w0.254: U1.67 24.05,36.04 24.05,36.47 21.34,39.18 R7.1
FDN: length 21.5
  Top Layer w0.254: R8.2 23.35,41.37 23.35,60.72 23.09,60.97 22.61,60.97 22.43,60.79 22.43,60.25 22.42,60.24
FDP: length 22.1
  Top Layer w0.254: 21.92,58.03 21.92,41.59 R7.2 ; 21.92,58.03 22.92,59.03 22.92,60.24 ; 21.92,58.03 21.92,60.24
GPIO0: length 35.3
  Top Layer w0.254: 3.87,61.76 8.46,57.17 8.46,44.25 15.74,36.97 17.98,36.97 18.36,37.35 19.38,37.35 20.05,36.68 20.05,35.79
GPIO1: length 33.4
  Top Layer w0.254: 19.68,35.94 19.68,36.54 19.23,36.99 18.5,36.99 18.13,36.61 15.6,36.61 8.11,44.1 8.11,55.23 3.37,59.97
GPIO2: length 30.3
  Top Layer w0.254: 4.28,57.34 7.75,53.86 7.75,43.95 15.47,36.24 18.25,36.24 18.65,36.63 19.08,36.63 19.27,36.45 19.27,35.97
GPIO3: length 28.2
  Top Layer w0.254: 3.68,54.52 5.65,54.52 7.4,52.77 7.4,43.81 15.32,35.88 18.86,35.88
GPIO4: length 23.8
  Top Layer w0.254: 4.07,51.93 7.03,48.97 7.03,46.97 7.04,46.97 7.04,43.66 15.77,34.93 17.76,34.93
GPIO5: length 21.8
  Top Layer w0.254: 18.02,34.54 15.66,34.54 6.68,43.52 6.68,46.82 4.22,49.28
GPIO6: length 20
  Top Layer w0.254: 17.68,34.12 15.57,34.12 6.32,43.37 6.32,45.48 5.01,46.79 4.16,46.79
GPIO7: length 18.3
  Top Layer w0.254: 4.02,44.76 4.43,44.76 15.45,33.74 17.72,33.74
GPIO8: length 18.8
  Top Layer w0.254: 17.8,32.9 15.03,32.9 14.93,32.8 13.9,32.8 13.69,33 13.69,34.05 13.9,34.26 13.9,34.78 6.88,41.8 4.08,41.8
GPIO9: length 17.9
  Top Layer w0.254: 18.03,32.54 16.72,32.54 16.62,32.44 12.86,32.44 12.34,32.96 12.34,34.09 7.12,39.31 3.66,39.31
GPIO10: length 16.3
  Top Layer w0.254: 3.81,36.49 9.43,36.49 11.98,33.95 11.98,32.81 12.71,32.09 16.77,32.09 ; 16.8,32.1 16.82,32.13 17.61,32.13
GPIO11: length 17.9
  Top Layer w0.254: 17.68,31.7 17.69,31.69 18.39,31.69 v2(19.19,32.49)
  Bottom Layer w0.254: 3.95,34.38 5.84,32.49 v2(19.19,32.49)
GPIO12: length 16.7
  Top Layer w0.254: v2(19.03,30.83) 18.96,30.9 17.83,30.9
  Bottom Layer w0.254: 19.13,30.86 18.24,31.75 4.04,31.75
GPIO13: length 17.6
  Top Layer w0.254: 18.96,30.01 18.44,30.53 17.9,30.53
  Bottom Layer w0.254: 4.16,29.25 6.14,31.22 17.81,31.22 18.79,30.25 18.96,30.25 19.06,30.14 19.06,29.96
  vias: v2(19.04,29.99)
GPIO14: length 15.7
  Top Layer w0.254: 17.96,30.09 16.64,30.09 16.28,30.45 12.04,30.45 8.26,26.67 J2.32
GPIO15: length 16.5
  Top Layer w0.254: U1.14 17.74,29.74 16.49,29.74 16.13,30.1 12.19,30.1 6.22,24.13 J2.34
GPIO16: length 18.7
  Top Layer w0.254: 17.93,28.89 16.85,28.89 15.09,27.13 15.09,24.24 12.44,21.59 J2.36
GPIO17: length 20.6
  Top Layer w0.254: J2.38 12.45,19.05 13.74,20.34 13.74,22.39 15.44,24.09 15.44,26.99 16.97,28.51 U1.17
GPIO18: length 25.5
  Top Layer w0.254: U1.18 17.07,28.11 15.8,26.84 15.8,23.94 14.09,22.24 14.09,16.49 11.96,14.35 6.1,14.35 J2.40
GPIO19: length 24.6
  Top Layer w0.254: U1.19 17.18,27.71 16.15,26.69 16.15,23.8 14.45,22.09 14.45,16.34 12.08,13.97 J2.42
GPIO20: length 25.5
  Top Layer w0.254: U1.20 17.28,27.31 16.51,26.54 16.51,23.65 14.81,21.94 14.81,16.19 10.05,11.43 J2.44
GPIO21: length 25.9
  Top Layer w0.254: J2.46 8.01,8.89 15.16,16.04 15.16,21.8 18.87,25.5 U1.21
GPIO22: length 27.4
  Top Layer w0.254: J2.48 4.44,6.86 6.48,6.86 15.52,15.9 15.52,21.65 19.27,25.4 U1.22
GPIO23: length 28.9
  Top Layer w0.254: J2.50 15.88,15.75 15.88,21.5 19.67,25.29 U1.23
GPIO24: length 31.8
  Top Layer w0.254: J2.52 17.91,15.24 17.91,22.53 20.45,25.07 20.45,26.19 U1.25
GPIO25: length 46.1
  Top Layer w0.254: 20.87,26.05 20.87,24.82 19.93,23.87 19.93,23.21 v2(19.95,23.19)
  Bottom Layer w0.254: 41.46,1.24 24.16,1.24 17.72,7.68 17.72,20.04 20.03,22.35 20.03,23.18
GPIO26: length 44.6
  Top Layer w0.254: U1.27 21.27,24.71 20.9,24.34 20.9,23.57 v2(20.83,23.49)
  Bottom Layer w0.254: 41.5,3.86 22.04,3.86 18.08,7.82 18.08,17.7 20.87,20.49 20.87,23.35
GPIO27: length 43.1
  Top Layer w0.254: U1.28 21.67,24.28 v2(21.48,24.1)
  Bottom Layer w0.254: 41.24,6.35 41.21,6.32 20.08,6.32 18.43,7.97 18.43,17.56 21.52,20.64 21.52,24.06
GPIO28: length 24.5
  Top Layer w0.254: 41.45,16.52 36.33,21.64 32.11,21.64 v2(32.05,21.7) ; 24.88,26.22 24.88,26.81 24.06,27.62
  Bottom Layer w0.254: v2(32.05,21.7) 31.59,22.16 28.3,22.16 25.86,24.61 25.86,25.88 24.1,27.63 24.1,27.66
  vias: v2(24.03,27.7)
GPIO29: length 22.5
  Top Layer w0.254: 41.29,18.98 37.98,22.3 32.57,22.3 ; 24.92,27.75 25.25,27.42 25.25,26.23
  Bottom Layer w0.254: 24.85,27.61 24.85,27.39 26.21,26.03 26.21,24.76 28.34,22.63 32.24,22.63 v2(32.57,22.3)
  vias: v2(24.92,27.69)
GPIO30: length 21.3
  Top Layer w0.254: v2(33.32,22.92) 33.34,22.9 40.02,22.9 41.22,21.7 ; 25.55,28.01 25.68,27.88 25.68,26.26
  Bottom Layer w0.254: v2(33.32,22.92) 33.26,22.98 28.49,22.98 26.57,24.9 26.57,26.17 25.69,27.05 25.69,27.91 25.6,28
  vias: v2(25.71,28.07)
GPIO31: length 23
  Top Layer w0.254: v2(25.84,29.18) 26.29,28.73 26.29,27.83 26.06,27.59 26.06,26.25 ; v2(34.08,23.52) 40.66,23.52 41.3,24.16
  Bottom Layer w0.254: v2(34.08,23.52) 34,23.6 28.38,23.6 26.93,25.05 26.93,26.32 26.29,26.95 26.29,28.72 25.85,29.16
GPIO32: length 20
  Top Layer w0.254: 26.48,26.4 26.48,27.51 26.65,27.68 26.65,30.06 v2(26.78,30.19)
  Bottom Layer w0.254: v2(26.78,30.19) 26.93,30.34 28.02,30.34 30.53,27.83 39.97,27.83 41.21,26.59
GPIO33: length 16.2
  Top Layer w0.254: 41.38,29.18 38.36,29.18 34.54,25.36 30.39,25.36 28.06,27.69 27.7,27.69
GPIO34: length 16.8
  Top Layer w0.254: 41.21,31.35 40.03,31.35 34.39,25.71 30.54,25.71 28.15,28.1 27.7,28.1
GPIO35: length 18.2
  Top Layer w0.254: 27.76,28.51 28.24,28.51 30.69,26.07 34.24,26.07 41.28,33.11 41.28,33.91
GPIO36: length 21.7
  Top Layer w0.254: 41.56,36.86 40.53,36.86 39.3,35.62 39.3,31.62 34.1,26.42 30.84,26.42 28.35,28.91 27.51,28.91
GPIO37: length 23.2
  Top Layer w0.254: 27.72,29.31 28.46,29.31 30.98,26.78 33.95,26.78 38.94,31.77 38.94,35.84 41.28,38.19 41.28,39.68
GPIO38: length 24.9
  Top Layer w0.254: 27.55,29.71 28.56,29.71 31.13,27.14 33.8,27.14 38.58,31.92 38.58,39.47 40.91,41.8
GPIO39: length 65.1
  Top Layer w0.254: 27.58,30.12 28.65,30.12 31.28,27.49 33.65,27.49 38.23,32.07 38.23,41.41 41.54,44.73 ; 29.07,16.16 29.05,16.19 29.05,17.73
  Bottom Layer w0.254: 29.02,17.71 33.35,17.71 38.89,23.25 38.89,23.61 40.75,25.47 41.8,25.47 42.7,26.36 42.7,43.36 41.74,44.32
  vias: v2(29.09,17.77)
GPIO40: length 29.3
  Top Layer w0.254: 33.57,27.91 37.87,32.21 37.87,43.22 41.5,46.85 ; 33.57,27.91 31.36,27.91 28.77,30.5 27.56,30.5
GPIO41: length 27.8
  Top Layer w0.254: 41.41,49.25 37.52,45.36 37.52,33.98 36.19,32.66 29.66,32.66 28.7,31.7 27.59,31.7
GPIO42: length 29.9
  Top Layer w0.254: 41.4,51.81 37.16,47.57 37.16,34.13 36.05,33.02 29.51,33.02 28.59,32.09 27.56,32.09
GPIO43: length 32.5
  Top Layer w0.254: 41.09,55.01 41.09,53.24 36.8,48.95 36.8,34.28 35.9,33.37 29.37,33.37 28.51,32.51 27.56,32.51
GPIO44: length 34.2
  Top Layer w0.254: 41.29,57.25 41.29,55.97 40.36,55.04 40.36,53.04 36.45,49.13 36.45,34.42 36.24,34.22 ; 36.2,34.25 35.68,33.73 29.22,33.73 28.38,32.89 27.63,32.89
GPIO45: length 34.2
  Top Layer w0.254: 27.57,33.29 26.75,33.29 26.33,32.87
  Bottom Layer w0.254: 41.29,59.48 41.29,58.67 27.54,44.92 27.54,34.13 26.36,32.95 26.31,32.95
  vias: v2(26.37,32.99)
GPIO46: length 35.9
  Top Layer w0.254: 26.43,33.7 27.66,33.7 27.67,33.69
  Bottom Layer w0.254: 41.21,62.17 41.11,62.17 38.78,59.85 38.78,56.67 26.94,44.83 26.94,34.82 26.96,34.81 26.96,34.32 26.62,33.98 26.59,33.98 26.38,33.77
  vias: v2(26.37,33.79)
GPIO47: length 37.8
  Top Layer w0.254: 27.61,34.1 27.58,34.14 27.13,34.14 26.81,34.45 26.5,34.45
  Bottom Layer w0.254: 41.25,64.91 41.25,63.56 38.43,60.73 38.43,56.97 26.47,45.02 26.47,34.51
  vias: v2(26.38,34.56)
QSPI_SS: length 15.9
  Top Layer w0.254: v2(21.08,37.34) 21.08,36.66 20.89,36.47 20.89,36.04 U1.75 ; v2(11.43,45.59) 11.43,46.85 R6.1
  Bottom Layer w0.254: v2(11.43,45.59) 19.69,37.34 v2(21.08,37.34)
RUN: length 54.6
  Top Layer w0.254: 14.16,51.06 14.16,49.85 v2(14.1,49.78) ; 41.13,13.92 35.99,19.06 31.8,19.06 31.73,19.13 v2(31.73,19.17) ; 24.47,26.21 24.45,26.23 24.45,26.66 24.28,26.82 23.85,26.82 23.06,27.62 23,27.62 22.97,27.65
  Bottom Layer w0.254: 23.06,27.78 21.67,29.17 21.67,37.58 14.14,45.11 14.14,49.81 ; 23.05,27.66 23.05,25.27 24.27,24.05 24.53,24.05 27.98,20.6 29.4,20.6 30.06,19.95 30.95,19.95 v2(31.73,19.17)
  vias: v2(23,27.69)
SWCLK: length 47.1
  Top Layer w0.254: v2(24.51,24.64) 23.67,25.48 U1.33 ; 39.98,8.89 41.36,8.89 41.41,8.85 ; 39.98,8.89 24.76,8.89 21.67,5.79 J4.1 ; 39.98,8.89 30.69,18.18 v2(30.69,20.55)
  Bottom Layer w0.254: 24.58,24.55 24.58,24.5 28.13,20.96 30.29,20.96 v2(30.69,20.55)
SWDIO: length 49.6
  Top Layer w0.254: J4.3 23.67,5.76 25.76,7.85 41.83,7.85 42.44,8.46 42.44,9.32 41.4,10.36 J3.43 ; 40.92,11.23 38.17,11.23 31.11,18.28 31.11,19.58 ; U1.34 24.09,26.19 24.09,25.66 24.52,25.22 24.75,25.22 25.18,24.79 v2(25.27,24.79) ; 31.17,19.63 31.47,19.93 31.47,20.92 31.59,21.04
  Bottom Layer w0.254: 31.48,21.17 31.33,21.31 28.27,21.31 25.36,24.23 25.36,24.71
  vias: v2(31.48,21.09)
VREG_AVDD: length 7.7
  Top Layer w0.254: 26.62,36.02 29.17,36.02 R3.2 ; 26.62,36.02 28.96,38.35 C9.1 ; 26.62,36.02 U1.61
VREG_LX: length 6.5
  Top Layer w0.254: U1.63 25.67,36.81 26.01,37.15 26.01,40.76 L1.1
XIN: length 11.5
  Top Layer w0.254: U1.30 22.48,26.2 22.48,20.11 22.49,20.11 22.49,18.68 22.48,18.67 22.48,18.54 21.59,17.65 C3.1
XOUT: length 3.4
  Top Layer w0.254: U1.31 22.86,26.2 22.86,24.76 23.97,23.66 R4.2
$1N1729: length 6.1
  Top Layer w0.254: XR1.1 18.73,63.25 20.92,61.06 20.92,60.24
$1N1837: length 6.3
  Top Layer w0.254: 23.92,60.24 23.92,60.83 26.32,63.23 XR2.1
$1N3371: length 7.6
  Top Layer w0.254: C4.1 24.81,15.99 24.81,18.41 23.88,19.34 23.88,19.35 23.83,19.39 23.97,19.52 R4.1
$1N4063: length 4.2
  Top Layer w0.254: 9.91,46.99 9.72,47.18 SW1.1
$1N4245: length 3.3
  Top Layer w0.254: SW2.4 16.31,56.57 R9.1
$2N5716: length 2.7
  Top Layer w0.254: 14.75,45.4 15.97,46.62 15.97,47.62
$2N5881: length 2.1
  Top Layer w0.254: 28.98,12.76 29.14,12.92 29.14,14.79

## Copper pours and planes (outline as drawn; the poured copper is in the pictures)
3V3 on Top Layer: 26.03,52.32 39.12,52.32 39.12,43.43 26.03,43.43
GND on Top Layer: 0.13,67.77 47.24,67.77 47.24,-2.79 0.13,-2.79
GND on Bottom Layer: -0.89,67.05 47.02,67.05 47.02,-1.39 -0.89,-1.39

## Text on the board
Bottom Silkscreen Layer: IN CALIFORNIA | MADE WITH | lvmlabs.org - hackclub.com | MADE BY | WITH | ❤️
Top Silkscreen Layer: RP2354B | ALWAYS ON | 1.1V | 3.3V | 5V | 3V3 | 0 | 1 | 2 | 3 | 4 | 5 | 6 | 7 | 8 | 9 | 10 | 11 | 12 | 13 | 14 | 15 | 16 | 17 | 18 | 19 | 20 | 21 | 22 | 23 | 24 | 0.1uF | 4.7uF | 1K | 5.1K | lvmlabs.org/hardware/rp2354b | COPYRIGHT 2026 | 220 | XIN | 15pF | XOUT | 10uF | 3.3uH | 3V3 / POUR | rev 1 | 33 | 47 | 46 | 43 | 42 | 41 | 40 | 38 | 37 | 36 | 35 | 34 | 32 | 31 | 30 | 29 | 28 | RUN | SWDIO | SWCLK | 27 | 26 | 25 | 39 | LED2 | 45 | 44 | FLIP | BLUE | DP | DN | GREEN | DEBUG | OUTER PINS GND | BOOTSEL | RESET | 1V1 | VBUS | GND | C6/7 | RP2354B Testboard
